# Altium schematic sheet Buck-Converter.SchDoc
size A4; SheetNumber: 1; SheetTotal: 1
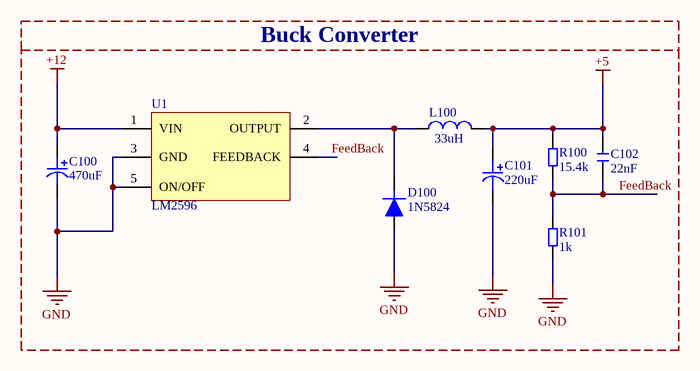
[diagram p0: Buck-Converter.SchDoc]

## Parts
C100  470uF  [F981C475MMA]
C101  220uF  [F981C475MMA]
C102  22nF  [CAP-0402-X7R]
D100  1N5824  [1N5824]
L100  33uH  [IND_0603]
R100  15.4k  [RES-0603]
R101  1k  [RES-0603]
U1  LM2596  [LM2596]

## Blocks framed on the sheet
Buck Converter: C100-C102 D100 L100 R100 R101 U1

## Nets
+5: C101.1 C102.2 L100.2 R100.2
+12: C100.1 U1.1(VIN)
GND: C100.2 C101.2 D100.1 R101.1 U1.3(GND) U1.5(ON/OFF)
FeedBack: C102.1 R100.1 R101.2 U1.4(FEEDBACK)
NetD100_2: D100.2 L100.1 U1.2(OUTPUT)

## Library data of the parts
C100 = CAP_0603_16V_Tantalum: Cap Tant Solid 100uF 63V M CASE 20%( 1.6 X 0.85 X 0.8mm) Inward L SMD 12 Ohm 125C T/R; Manufacturer: Kyocera AVX; Capacitance: 4.7uF; Voltage Rating: 16V; ESR (Equivalent Series Resistance): 12R; Supplier 1: RSComponents; Manufacturer Part Number: F981C475MMA; RoHS: Yes; Category: Tantalum Capacitors; Stock 1: 1; Mount: Surface Mount; Case/Package: 0603; Case Code (Imperial): 0603; Case Code (Metric): 1608; Min Operating Temperature: -55°C; Max Operating Temperature: 125°C; Features: General Purpose; Packaging: Tape and Reel; Tolerance: 20%; RoHS Compliant: Yes; ComponentLink1URL: http://www.farnell.com/datasheets/2602422.pdf?src-supplier=Farnell; ComponentLink1Description: http://www.farnell.com/datasheets/2602422.pdf?src-supplier=Farnell; ComponentLink2URL: http://www.mouser.com/ds/2/40/AVX_F98%20DTSH%2008_16-974527.pdf?src-supplier=Mouser; ComponentLink2Description: http://www.mouser.com/ds/2/40/AVX_F98%20DTSH%2008_16-974527.pdf?src-supplier=Mouser; ComponentLink3URL: http://datasheets.avx.com/F98.pdf?src-supplier=Digi-Key; ComponentLink3Description: http://datasheets.avx.com/F98.pdf?src-supplier=Digi-Key; ComponentLink4URL: http://www.farnell.com/datasheets/2602422.pdf?src-supplier=Newark; ComponentLink4Description: http://www.farnell.com/datasheets/2602422.pdf?src-supplier=Newark; Supplier Part Number 1: 1361275
C101 = CAP_0603_16V_Tantalum: Cap Tant Solid 220uF 35V M CASE 20%( 1.6 X 0.85 X 0.8mm) Inward L SMD 12 Ohm 125C T/R; Manufacturer: Kyocera AVX; Capacitance: 4.7uF; Voltage Rating: 16V; ESR (Equivalent Series Resistance): 12R; Supplier 1: RSComponents; Manufacturer Part Number: F981C475MMA; RoHS: Yes; Category: Tantalum Capacitors; Stock 1: 1; Mount: Surface Mount; Case/Package: 0603; Case Code (Imperial): 0603; Case Code (Metric): 1608; Min Operating Temperature: -55°C; Max Operating Temperature: 125°C; Features: General Purpose; Packaging: Tape and Reel; Tolerance: 20%; RoHS Compliant: Yes; ComponentLink1URL: http://www.farnell.com/datasheets/2602422.pdf?src-supplier=Farnell; ComponentLink1Description: http://www.farnell.com/datasheets/2602422.pdf?src-supplier=Farnell; ComponentLink2URL: http://www.mouser.com/ds/2/40/AVX_F98%20DTSH%2008_16-974527.pdf?src-supplier=Mouser; ComponentLink2Description: http://www.mouser.com/ds/2/40/AVX_F98%20DTSH%2008_16-974527.pdf?src-supplier=Mouser; ComponentLink3URL: http://datasheets.avx.com/F98.pdf?src-supplier=Digi-Key; ComponentLink3Description: http://datasheets.avx.com/F98.pdf?src-supplier=Digi-Key; ComponentLink4URL: http://www.farnell.com/datasheets/2602422.pdf?src-supplier=Newark; ComponentLink4Description: http://www.farnell.com/datasheets/2602422.pdf?src-supplier=Newark; Supplier Part Number 1: 1361275
C102 = CAP-0402-X7R-0.1uF: 0402 100 nF 25 V ±10 % Tolerance X7R Surface Mount Multilayer Ceramic Capacitor; Manufacturer: Kyocera AVX; Manufacturer Part Number: 04023C104KAT2A; Capacitance: 100nF; Tolerance: 10%; Voltage Rating (DC): 25V; Supplier 1: Digi-Key; RoHS: Yes; Category: Ceramic Capacitors; Stock 1: 6710469; Pricing 1: 1=0,10000, 10=0,03600, 50=0,01980, 100=0,01620, 500=0,01156, 1000=0,00908, 2500=0,00825, 5000=0,00759 (USD); Mount: Surface Mount; Case/Package: 0402; Number of Pins: 2; Case Code (Metric): 1005; Case Code (Imperial): 0402; Min Operating Temperature: -55°C; Max Operating Temperature: 125°C; Dielectric: X7R; Packaging: Tape and Reel; Voltage Rating: 25V; Package Quantity: 1; Termination: SMD/SMT; Voltage: 25V; Length: 1mm; Width: 0.02inch; Depth: 0.5mm; Thickness: 0.022inch; Radiation Hardening: No; REACH SVHC: No SVHC; Lead Free: Lead Free; ComponentLink1URL: https://datasheet.ciiva.com/1123/1679506-1123344.pdf?src-supplier=Element14; ComponentLink1Description: https://datasheet.ciiva.com/1123/1679506-1123344.pdf?src-supplier=Element14; ComponentLink2URL: https://datasheet.ciiva.com/7614/cx7r-7614663.pdf?src-supplier=Digi-Key; ComponentLink2Description: https://datasheet.ciiva.com/7614/cx7r-7614663.pdf?src-supplier=Digi-Key; ComponentLink3URL: https://datasheet.ciiva.com/7709/1679506-7709527.pdf?src-supplier=Element14; ComponentLink3Description: https://datasheet.ciiva.com/7709/1679506-7709527.pdf?src-supplier=Element14; ComponentLink4URL: https://datasheet.ciiva.com/6265/cx7r-6265272.pdf?src-supplier=Digi-Key; ComponentLink4Description: https://datasheet.ciiva.com/6265/cx7r-6265272.pdf?src-supplier=Digi-Key; ComponentLink5URL: https://datasheet.ciiva.com/14906/cx7r-14906223.pdf?src-supplier=Digi-Key; ComponentLink5Description: https://datasheet.ciiva.com/14906/cx7r-14906223.pdf?src-supplier=Digi-Key; Supplier Part Number 1: 478-7868-1-ND
D100 = 1N5824: Diode Schottky 30V 5A 2-Pin Axial Leaded Tray; Manufacturer: Microsemi; Forward Voltage: 490mV; Max Reverse Current: 10mA; Peak Non-Repetitive Surge Current: 500A; Element Configuration: Single; Supplier 1: Newark; Manufacturer Part Number: 1N5824; RoHS: Yes; Category: Rectifier Diodes; Mount: Through Hole; Case/Package: Axial; Number of Pins: 2; Min Operating Temperature: -65°C; Max Operating Temperature: 125°C; Packaging: Bulk; Series: -; Forward Current: 5A; Average Rectified Current: 5A; Max Repetitive Reverse Voltage (Vrrm): 30V; Max Reverse Voltage (DC): 30V; Radiation Hardening: No; RoHS Compliant: Yes; ComponentLink1URL: http://www.microsemi.com/document-portal/doc_download/5865-1n5823-25-pdf?src-supplier=Avnet; ComponentLink1Description: http://www.microsemi.com/document-portal/doc_download/5865-1n5823-25-pdf?src-supplier=Avnet; ComponentLink2URL: https://www.microsemi.com/document-portal/doc_download/5865-1n5823-25-datasheet?src-supplier=Digi-Key; ComponentLink2Description: https://www.microsemi.com/document-portal/doc_download/5865-1n5823-25-datasheet?src-supplier=Digi-Key; ComponentLink3URL: http://www.microsemi.com/datasheets/1N5823-25.PDF?src-supplier=Mouser; ComponentLink3Description: http://www.microsemi.com/datasheets/1N5823-25.PDF?src-supplier=Mouser; Supplier Part Number 1: 34AJ0587
L100 = Inductor
R100 R101 = RES-0603-1k: 贴片电阻 1000Ω ± 1.00% 0.1W ± 100ppm/℃ 0603; Manufacturer: Vishay Dale; Manufacturer Part Number: CRCW06031K00FKEA; Resistance: 1kR; Power Rating: 100mW; Temperature Coefficient: 100ppm/°C; Tolerance: 1%; Voltage Rating: 75V; Supplier 1: Newark; RoHS: Yes; Category: Chip SMD Resistors; Pricing 1: 1=0,12500, 10=0,05300, 25=0,04300, 50=0,03100, 100=0,02100 (USD); Mount: Surface Mount; Case/Package: 0603; Number of Pins: 2; Case Code (Metric): 1608; Case Code (Imperial): 0603; Contact Plating: Tin; Size Code: 0603; Weight: 7.1E-05oz; Min Operating Temperature: -55°C; Max Operating Temperature: 155°C; Packaging: Tape and Reel; Max Power Dissipation: 100mW; Series: CRCW; Resistor Type: Thick Film; Package Quantity: 10; Number of Terminations: 2; Termination: SMD/SMT; Features: Automotive AEC-Q200; Construction: Rectangular; Voltage Rating (DC): 75V; Resistance Tolerance: 1%; Technology: THICK FILM; Length: 1.55mm; Width: 0.033inch; Height: 0.45mm; Depth: 0.85mm; Radiation Hardening: No; Lead Free: Lead Free; RoHS Compliant: Yes; Military Standard: Not; REACH SVHC: Unknown; ComponentLink1URL: https://datasheet.ciiva.com/11808/0900766b80d98afc-11808625.pdf?src-supplier=RSComponents; ComponentLink1Description: https://datasheet.ciiva.com/11808/0900766b80d98afc-11808625.pdf?src-supplier=RSComponents; ComponentLink2URL: https://datasheet.ciiva.com/46441/1720486-46441623.pdf?src-supplier=Element14; ComponentLink2Description: https://datasheet.ciiva.com/46441/1720486-46441623.pdf?src-supplier=Element14; ComponentLink3URL: https://datasheet.ciiva.com/46441/1720486-46441622.pdf?src-supplier=Element14; ComponentLink3Description: https://datasheet.ciiva.com/46441/1720486-46441622.pdf?src-supplier=Element14; ComponentLink4URL: https://datasheet.ciiva.com/26316/fld-crcw-e3-data-en-26316551.pdf?src-supplier=Distrelec; ComponentLink4Description: https://datasheet.ciiva.com/26316/fld-crcw-e3-data-en-26316551.pdf?src-supplier=Distrelec; ComponentLink5URL: https://datasheet.ciiva.com/46385/1697337-46385497.pdf?src-supplier=Element14; ComponentLink5Description: https://datasheet.ciiva.com/46385/1697337-46385497.pdf?src-supplier=Element14; ComponentLink6URL: https://datasheet.ciiva.com/2465/dcrcwe3-2465535.pdf?src-supplier=Digi-Key; ComponentLink6Description: https://datasheet.ciiva.com/2465/dcrcwe3-2465535.pdf?src-supplier=Digi-Key; ComponentLink7URL: https://datasheet.ciiva.com/2465/dcrcwe3-2465536.pdf?src-supplier=Digi-Key; ComponentLink7Description: https://datasheet.ciiva.com/2465/dcrcwe3-2465536.pdf?src-supplier=Digi-Key; ComponentLink8URL: https://datasheet.ciiva.com/2465/dcrcwe3-2465534.pdf?src-supplier=Digi-Key; ComponentLink8Description: https://datasheet.ciiva.com/2465/dcrcwe3-2465534.pdf?src-supplier=Digi-Key; ComponentLink9URL: https://datasheet.ciiva.com/16515/dcrcwe3-16515078.pdf?src-supplier=Avnet+Asia; ComponentLink9Description: https://datasheet.ciiva.com/16515/dcrcwe3-16515078.pdf?src-supplier=Avnet+Asia; ComponentLink10URL: https://datasheet.ciiva.com/8336/dcrcwe3-8336822.pdf?src-supplier=Avnet; ComponentLink10Description: https://datasheet.ciiva.com/8336/dcrcwe3-8336822.pdf?src-supplier=Avnet; ComponentLink11URL: https://datasheet.ciiva.com/16199/dcrcwe3-16199053.pdf?src-supplier=Future+Electronics; ComponentLink11Description: https://datasheet.ciiva.com/16199/dcrcwe3-16199053.pdf?src-supplier=Future+Electronics; ComponentLink12URL: https://datasheet.ciiva.com/16893/dcrcwe3-16893742.pdf?src-supplier=Avnet+Europe; ComponentLink12Description: https://datasheet.ciiva.com/16893/dcrcwe3-16893742.pdf?src-supplier=Avnet+Europe; ComponentLink13URL: https://datasheet.ciiva.com/3257/dcrcwe3-3257132.pdf?src-supplier=Avnet; ComponentLink13Description: https://datasheet.ciiva.com/3257/dcrcwe3-3257132.pdf?src-supplier=Avnet; Supplier Part Number 1: 61M5328
U1 = LM2596: IC REG BUCK ADJ 3A TO263-5; Manufacturer: TI National Semiconductor; Manufacturer Part Number: LM2596SX-ADJ/NOPB; Number of Outputs: 1; Output Voltage: 37V; Efficiency: 73%; Min Input Voltage: 4.5V; Max Input Voltage: 40V; Switching Frequency: 150kHz; Output Type: Adjustable; Min Output Voltage: 1.2V; Synchronous Rectifier: No; Quiescent Current: 5mA; Output Configuration: Positive; Supplier 1: Mouser; RoHS: Yes; Pricing 1: 1=6,86000, 10=6,17000, 50=5,83000, 100=5,13000, 1000=4,78000, 10000=4,78000 (USD); Mount: Surface Mount; Case/Package: TO-263; Number of Pins: 5; Weight: 0.056128oz; Contact Plating: Tin,Matte; Min Operating Temperature: -40°C; Max Operating Temperature: 125°C; Output Current: 3A; Packaging: Tape and Reel; Max Output Current: 3A; Series: SIMPLE SWITCHER®; Operating Supply Voltage: 40V; Package Quantity: 500; Max Output Voltage: 37V; Min Supply Voltage: 4.5V; Length: 0.25inch; Width: 0.25inch; Height: 0.25inch; Radiation Hardening: No; Reach SVHC Compliant: Yes; Lead Free: Contains Lead; RoHS Compliant: Yes; ComponentLink1URL: https://datasheet.ciiva.com/22756/1768026-22756627.pdf?src-supplier=Farnell; ComponentLink1Description: https://datasheet.ciiva.com/22756/1768026-22756627.pdf?src-supplier=Farnell; ComponentLink2URL: https://datasheet.ciiva.com/22669/1874590-22669466.pdf?src-supplier=Element14; ComponentLink2Description: https://datasheet.ciiva.com/22669/1874590-22669466.pdf?src-supplier=Element14; ComponentLink3URL: https://datasheet.ciiva.com/46419/1768026-46419163.pdf?src-supplier=Element14; ComponentLink3Description: https://datasheet.ciiva.com/46419/1768026-46419163.pdf?src-supplier=Element14; ComponentLink4URL: https://datasheet.ciiva.com/6603/lm2596-6603277.pdf?src-supplier=Digi-Key; ComponentLink4Description: https://datasheet.ciiva.com/6603/lm2596-6603277.pdf?src-supplier=Digi-Key; Supplier Part Number 1: 926-LM2596SX-ADJNOPB